# EAGLE schematic transimpedance_amp_simple (EAGLE 7.6.0)
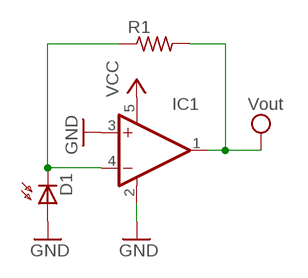
[diagram p0: schematic, sheet 1]

## Parts
D1  BP104  [BP104]
IC1  OPA336N  [SOT23-5]
R1  R-US_0204/5  [0204/5]

## Nets
GND: D1.A IC1.2(V-) IC1.3(+IN)
N$1: D1.K(C) IC1.4(-IN) R1.1
VCC: IC1.1(OUT) IC1.5(V+) R1.2 ; supply symbol labelled Vout

## Library data of the parts
D1 = opto-trans-siemens:BP104: PHOTO DIODE; MF: VISHAY/TELEFUNKEN; MPN: BP104; OC_FARNELL: 1779636; OC_NEWARK: 14M4504
IC1 = burr-brown:OPA336: CMOS Operational Amplifiers Single-Supply, MicroPower, MicroAmplifier(TM) Series; MPN: OPA336NA; OC_FARNELL: 1212297; OC_NEWARK: 01M8405
R1 = rcl:R-US_: RESISTOR, American symbol